# EAGLE design untitled (EAGLE 9.1.0)
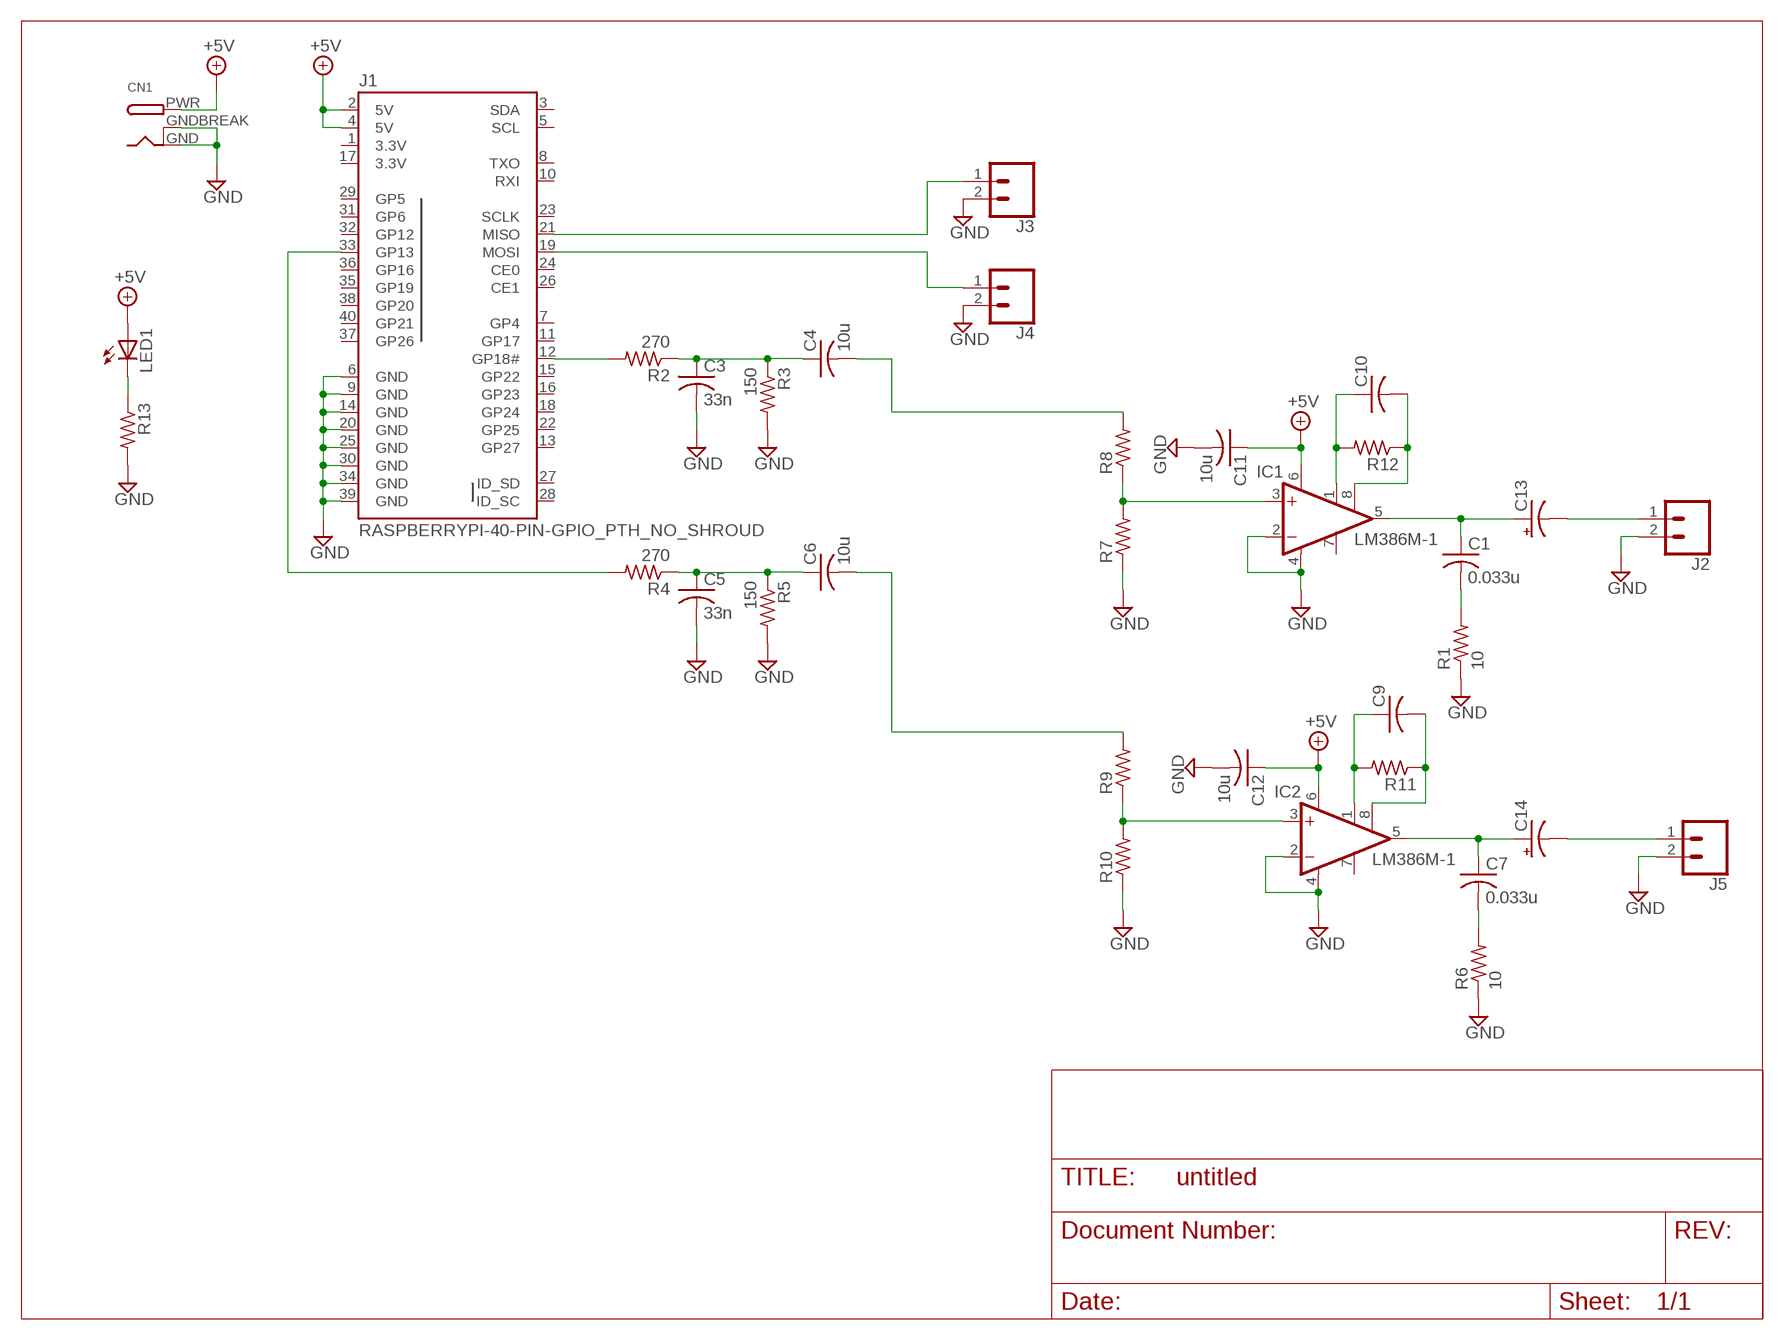
[diagram p0: schematic, sheet 1]

## Parts
C1  0.033u  C-USC0805  [C0805]
C3  33n  C-USC0805  [C0805]
C4  10u  C-USC0805  [C0805]
C5  33n  C-USC0805  [C0805]
C6  10u  C-USC0805  [C0805]
C7  0.033u  C-USC0805  [C0805]
C9  C-USC0805  [C0805]
C10  C-USC0805  [C0805]
C11  10u  C-USC0805  [C0805]
C12  10u  C-USC0805  [C0805]
C13  CPOL-USD  [PANASONIC_D]
C14  CPOL-USD  [PANASONIC_D]
CN1  DCBARRELPTH  [DCJACK_2MM_PTH]
IC1  LM386M-1  [SO08]
IC2  LM386M-1  [SO08]
J1  RASPBERRYPI-40-PIN-GPIO_PTH_NO_SHROUD  [2X20]
J2  CONN_02  [1X02]
J3  CONN_02  [1X02]
J4  CONN_02  [1X02]
J5  CONN_02  [1X02]
LED1  LEDCHIP-LED0805  [CHIP-LED0805]
R1  10  R-US_R0805  [R0805]
R2  270  R-US_R0805  [R0805]
R3  150  R-US_R0805  [R0805]
R4  270  R-US_R0805  [R0805]
R5  150  R-US_R0805  [R0805]
R6  10  R-US_R0805  [R0805]
R7  R-US_R0805  [R0805]
R8  R-US_R0805  [R0805]
R9  R-US_R0805  [R0805]
R10  R-US_R0805  [R0805]
R11  R-US_R0805  [R0805]
R12  R-US_R0805  [R0805]
R13  R-US_R0805  [R0805]

## Nets
+5V: C11.1 C12.1 CN1.PWR IC1.6(VS) IC2.6(VS) J1.2(5V) J1.4(5V) LED1.A
AUDIO_0: C4.2 R8.2
AUDIO_1: C6.2 R9.2
GND: C3.2 C5.2 C11.2 C12.2 CN1.GND CN1.GNDBREAK IC1.2(-IN) IC1.4(GND) IC2.2(-IN) IC2.4(GND) J1.6(GND) J1.9(GND) J1.14(GND) J1.20(GND) J1.25(GND) J1.30(GND) J1.34(GND) J1.39(GND) J2.2 J3.2 J4.2 J5.2 R1.1 R3.2 R5.2 R6.1 R7.1 R10.1 R13.2
N$1: C1.1 C13.+ IC1.5(OUT)
N$2: C1.2 R1.2
N$3: C13.- J2.1
N$4: J1.21(MISO) J3.1
N$5: J1.19(MOSI) J4.1
N$6: J1.12(GP18#) R2.2
N$7: J1.33(GP13) R4.2
N$8: C3.1 C4.1 R2.1 R3.1
N$9: C5.1 C6.1 R4.1 R5.1
N$10: C7.1 C14.+ IC2.5(OUT)
N$11: C7.2 R6.2
N$12: C14.- J5.1
N$13: IC2.3(+IN) R9.1 R10.2
N$14: IC1.3(+IN) R7.2 R8.1
N$15: C9.1 IC2.1(GAIN) R11.2
N$16: C9.2 IC2.8(GAIN) R11.1
N$17: C10.1 IC1.1(GAIN) R12.2
N$18: C10.2 IC1.8(GAIN) R12.1
N$19: LED1.C R13.1
Unconnected: IC1.7(BYPASS) IC2.7(BYPASS) J1.3(SDA) J1.5(SCL) J1.7(GP4) J1.8(TXO) J1.10(RXI) J1.11(GP17) J1.13(GP27) J1.15(GP22) J1.16(GP23) J1.18(GP24) J1.22(GP25) J1.23(SCLK) J1.24(CE0) J1.26(CE1) J1.27(ID_SD) J1.28(ID_SC) J1.29(GP5) J1.31(GP6) J1.32(GP12) J1.35(GP19) J1.36(GP16) J1.37(GP26) J1.38(GP20) J1.40(GP21)

## Power pins joined to a net without a drawn wire
3.3V: J1.1(3.3V) J1.17(3.3V)

## Library data of the parts
C1 C3-C7 C9-C12 = rcl:C-US: CAPACITOR, American symbol; SPICEPREFIX: C
C13 C14 = rcl:CPOL-US: POLARIZED CAPACITOR, American symbol; SPICEPREFIX: C
CN1 = adafruit:DCBARREL: 2.0mm DC Barrel Jack DCJACK_2MM_PTH - Through Hole Jack (4UConnector: 05537)
IC1 IC2 = linear:LM386?-*: Low Voltage Audio Power Amplifier Source: http://cache.national.com/ds/LM/LM386.pdf
J1 = SparkFun-Connectors:RASPBERRYPI-40-PIN-GPIO: Raspberry Pi GPIO Header 2x20 pin connector, as found on B, B+, A+ models. Both shrouded PTH and SMT versions available. SparkFun Products: GPIO Shrouded Header <https://www.sparkfun.com/products/13054>- PTH SparkFun Pi Wedge (Preassembled) <https://www.sparkfun.com/products/13717>
J2-J5 = SparkFun-Connectors:CONN_02: Multi connection point. Often used as Generic Header-pin footprint for 0.1 inch spaced/style header connections On any of the 0.1 inch spaced packages, you can populate with these: Break Away Headers - Straight <https://www.sparkfun.com/products/116> (PRT-00116) Break Away Male Headers - Right Angle <https://www.sparkfun.com/products/553> (PRT-00553) Female Headers <https://www.sparkfun.com/products/115> (PRT-00115) Break Away Headers - Machine Pin <https://www.sparkfun.com/products/117> (PRT-00117) Break Away Female Headers - Swiss Machine Pin <https://www.sparkfun.com/products/743> (PRT-00743) For SCREWTERMINALS and SPRING TERMINALS visit here: Screw Terimnals on SparkFun.com <https://www.sparkfun.com/search/results?term=Screw+Terminals> (5mm/3.5mm/2.54mm spacing) This device is also useful as a general connection point to wire up your design to another part of your project. Our various solder wires solder well into these plated through hole pads. Hook-Up Wire - Assortment (Stranded, 22 AWG) <https://www.sparkfun.com/products/11375> (PRT-11375) Hook-Up Wire - Assortment (Solid Core, 22 AWG) <https://www.sparkfun.com/products/11367> (PRT-11367) View the entire wire category on our website here <https://www.sparkfun.com/categories/141> Special notes: Molex polarized connector foot print use with: PRT-08233 with associated crimp pins and housings. 2.54_SCREWTERM for use with PRT-10571. 3.5mm Screw Terminal footprints for PRT-08084 5mm Screw Terminal footprints for use with PRT-08432
LED1 = led:LED: LED OSRAM: - CHIPLED LG R971, LG N971, LY N971, LG Q971, LY Q971, LO R971, LY R971 LH N974, LH R974 LS Q976, LO Q976, LY Q976 LO Q996 - Hyper CHIPLED LW Q18S LB Q993, LB Q99A, LB R99A - SideLED LS A670, LO A670, LY A670, LG A670, LP A670 LB A673, LV A673, LT A673, LW A673 LH A674 LY A675 LS A676, LA A676, LO A676, LY A676, LW A676 LS A679, LY A679, LG A679 - Hyper Micro SIDELED® LS Y876, LA Y876, LO Y876, LY Y876 LT Y87S - SmartLED LW L88C, LW L88S LB L89C, LB L89S, LG L890 LS L89K, LO L89K, LY L89K LS L896, LA L896, LO L896, LY L896 - TOPLED LS T670, LO T670, LY T670, LG T670, LP T670 LSG T670, LSP T670, LSY T670, LOP T670, LYG T670 LG T671, LOG T671, LSG T671 LB T673, LV T673, LT T673, LW T673 LH T674 LS T676, LA T676, LO T676, LY T676, LB T676, LH T676, LSB T676, LW T676 LB T67C, LV T67C, LT T67C, LS T67K, LO T67K, LY T67K, LW E67C LS E67B, LA E67B, LO E67B, LY E67B, LB E67C, LV E67C, LT E67C LW T67C LS T679, LY T679, LG T679 LS T770, LO T770, LY T770, LG T770, LP T770 LB T773, LV T773, LT T773, LW T773 LH T774 LS E675, LA E675, LY E675, LS T675 LS T776, LA T776, LO T776, LY T776, LB T776 LHGB T686 LT T68C, LB T68C - Hyper Mini TOPLED® LB M676 - Mini TOPLED Santana® LG M470 LS M47K, LO M47K, LY M47K Source: http://www.osram.convergy.de LUXEON: - LUMILED® LXK2-PW12-R00, LXK2-PW12-S00, LXK2-PW14-U00, LXK2-PW14-V00 LXK2-PM12-R00, LXK2-PM12-S00, LXK2-PM14-U00 LXK2-PE12-Q00, LXK2-PE12-R00, LXK2-PE12-S00, LXK2-PE14-T00, LXK2-PE14-U00 LXK2-PB12-K00, LXK2-PB12-L00, LXK2-PB12-M00, LXK2-PB14-N00, LXK2-PB14-P00, LXK2-PB14-Q00 LXK2-PR12-L00, LXK2-PR12-M00, LXK2-PR14-Q00, LXK2-PR14-R00 LXK2-PD12-Q00, LXK2-PD12-R00, LXK2-PD12-S00 LXK2-PH12-R00, LXK2-PH12-S00 LXK2-PL12-P00, LXK2-PL12-Q00, LXK2-PL12-R00 Source: www.luxeon.com KINGBRIGHT: KA-3528ASYC Source: www.kingbright.com
R1-R13 = rcl:R-US_: RESISTOR, American symbol; SPICEPREFIX: R

## Board
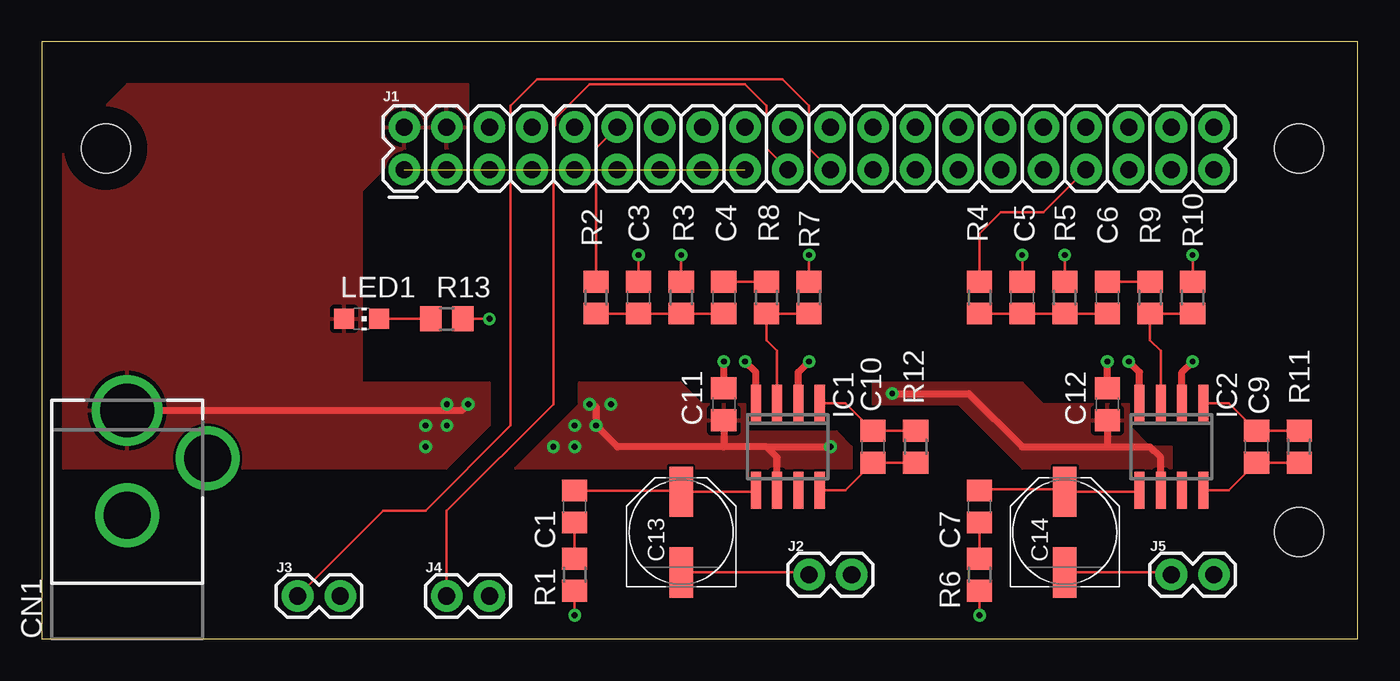
[diagram p1: board, top side]
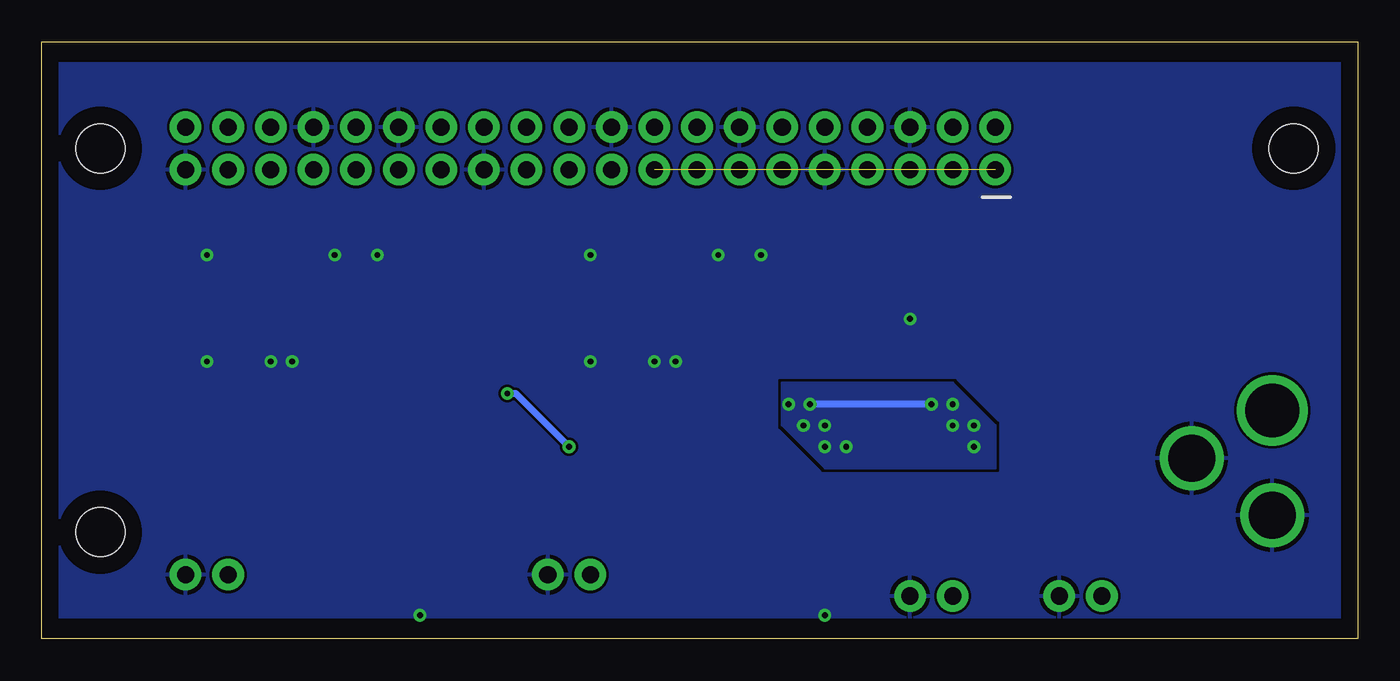
[diagram p2: board, bottom side, seen from below]

Size 78.41 x 35.55 mm. Coordinates in mm from the lower left corner, seen from the top.
Outline: 0,0 78.41,0 78.41,35.55 0,35.55 0,0
Copper layers (1*16): Top 0.035mm / dielectric 1.5mm / Bottom 0.035mm
Design rules "default *": minimum track width 6mil, minimum drill 0.35mm, track to track 6mil, track to pad 6mil, pad to pad 6mil, via to via 6mil, smd to smd 6mil, copper to edge 40mil, drill to drill 6mil, minimum pad ring 10mil, minimum via ring 8mil, stop-mask expansion 4mil, vias tented up to drill 15mil, thermal gap 10mil
Holes 2.92 mm at 74.93,29.21 74.93,6.35 3.81,29.21

### Footprints (pad centres in the part's own frame; a part is rotated, then mirrored left to right if it is on the bottom)
C0805 = smd 1.3 x 1.5: 1 -0.95,0; 2 0.95,0
PANASONIC_D = smd 3 x 1.4: + 2.4,0; - -2.4,0
DCJACK_2MM_PTH = drill 2.8: GND 0,7.35; GNDBREAK 4.8,10.75 | drill 3.2: PWR 0,13.6
SO08 = smd 0.6 x 2.2: 1 -1.905,-2.6; 2 -0.635,-2.6; 3 0.635,-2.6; 4 1.905,-2.6; 5 1.905,2.6; 6 0.635,2.6; 7 -0.635,2.6; 8 -1.905,2.6
2X20 = drill 1.016 pad 1.88: 1 0,0; 2 0,2.54; 3 2.54,0; 4 2.54,2.54; 5 5.08,0; 6 5.08,2.54; 7 7.62,0; 8 7.62,2.54; 9 10.16,0; 10 10.16,2.54; 11 12.7,0; 12 12.7,2.54; 13 15.24,0; 14 15.24,2.54; 15 17.78,0; 16 17.78,2.54; 17 20.32,0; 18 20.32,2.54; 19 22.86,0; 20 22.86,2.54; 21 25.4,0; 22 25.4,2.54; 23 27.94,0; 24 27.94,2.54; 25 30.48,0; 26 30.48,2.54; 27 33.02,0; 28 33.02,2.54; 29 35.56,0; 30 35.56,2.54; 31 38.1,0; 32 38.1,2.54; 33 40.64,0; 34 40.64,2.54; 35 43.18,0; 36 43.18,2.54; 37 45.72,0; 38 45.72,2.54; 39 48.26,0; 40 48.26,2.54
1X02 = drill 1.016 pad 1.88: 1 0,0; 2 2.54,0
CHIP-LED0805 = smd 1.2 x 1.2: A 0,-1.05; C 0,1.05
R0805 = smd 1.3 x 1.5: 1 -0.95,0; 2 0.95,0

### Placement (x,y rotation side)
C1  31.75,7.87 270 top
C3  35.56,20.32 90 top
C4  40.64,20.32 90 top
C5  58.42,20.32 90 top
C6  63.5,20.32 90 top
C7  55.88,7.87 270 top
C9  72.39,11.43 270 top
C10  49.53,11.43 270 top
C11  40.64,13.97 90 top
C12  63.5,13.97 90 top
C13  38.1,6.35 90 top
C14  60.96,6.35 90 top
CN1  5.08,0 0 top
IC1  44.45,11.43 180 top
IC2  67.31,11.43 180 top
J1  21.59,27.94 0 top
J2  45.72,3.81 0 top
J3  15.24,2.54 0 top
J4  24.13,2.54 0 top
J5  67.31,3.81 0 top
LED1  19.05,19.05 270 top
R1  31.75,3.81 90 top
R2  33.02,20.32 90 top
R3  38.1,20.32 90 top
R4  55.88,20.32 90 top
R5  60.96,20.32 90 top
R6  55.88,3.81 90 top
R7  45.72,20.32 270 top
R8  43.18,20.32 90 top
R9  66.04,20.32 90 top
R10  68.58,20.32 270 top
R11  74.93,11.43 90 top
R12  52.07,11.43 90 top
R13  24.13,19.05 0 top

### Tracks (layer width: path | path; a pad name or v marks a point on that pad's centre or on a via)
3.3V  (1 unrouted)
+5V  (via drill 0.35)
  Top 0.406: CN1.PWR 25.03,13.6 v25.4,13.97 | 43.18,11.43 40.64,11.43 | 40.64,11.43 34.29,11.43 v33.02,12.7 33.02,13.84 32.77,13.84 v32.64,13.97 | IC1.6 43.81,10.79 43.18,11.43 | 43.18,11.43 v46.99,11.43 | v50.67,14.61 55.24,14.61 58.42,11.43 63.5,11.43 | 63.5,11.43 66.04,11.43 66.67,10.79 IC2.6 | C11.1 40.64,11.43 | C12.1 63.5,11.43
  Bottom 0.406: v25.4,13.97 v32.64,13.97 | v46.99,11.43 50.16,14.61 v50.67,14.61
  other vias: 24.13,13.97 24.13,12.7 22.86,12.7 22.86,11.43 33.91,13.97 31.75,12.7 31.75,11.43 30.48,11.43
  pour Top: 1.27,10.16 19.05,10.16 24.13,10.16 26.67,12.7 26.67,15.24 19.05,15.24 19.05,26.67 21.59,29.21 25.4,29.21 25.4,33.02 5.08,33.02 1.27,29.21
  pour Top: 32,15.24 35.56,15.24 38.1,15.24 39.37,13.97 41.91,13.97 41.91,12.32 47.37,12.32 48.26,11.43 48.26,10.16 44.45,10.16 43.18,10.16 28.19,10.16 32,13.97
  pour Bottom (isolate 0.305): 25.4,15.24 33.02,15.24 34.29,15.24 34.29,12.7 31.75,10.16 21.59,10.16 21.59,12.7 24.13,15.24
  pour Top: 49.53,15.24 58.42,15.24 59.69,13.97 64.77,13.97 64.77,12.7 66.04,11.43 67.31,11.43 67.31,10.16 64.77,10.16 62.23,10.16 58.42,10.16 54.61,13.97 49.53,13.97
AUDIO_0
  Top 0.152: C4.2 R8.2
AUDIO_1
  Top 0.152: C6.2 R9.2
GND  (via drill 0.35)
  Top 0.152: C3.2 v35.56,22.86 | R3.2 v38.1,22.86 | R7.1 v45.72,22.86 | C5.2 v58.42,22.86 | R5.2 v60.96,22.86 | R10.1 v68.58,22.86 | R13.2 v26.67,19.05 | R6.1 v55.88,1.39 | R1.1 v31.75,1.39
  Top 0.406: C12.2 v63.5,16.51 | C11.2 v40.64,16.51 | IC1.4 42.55,15.88 v41.91,16.51 | IC2.4 65.41,15.88 v64.77,16.51 | IC2.2 67.94,15.88 v68.58,16.51 | IC1.2 45.09,15.88 v45.72,16.51
  pour Bottom (rank 2): 0,34.29 0,1.27 78.74,1.27 78.74,26.67 78.74,34.29 2.54,34.29
N$1
  Top 0.152: IC1.5 42.47,8.75 C13.+ 38.24,8.75 38.17,8.82 C1.1
N$2
  Top 0.152: R1.2 C1.2
N$3
  Top 0.152: 45.72,4.13 J2.1 45.58,3.95 C13.-
N$4
  Top 0.152: J1.21 45.72,29.21 45.72,31.75 44.15,33.33 29.52,33.33 27.94,31.75 27.94,12.7 22.86,7.62 20.32,7.62 J3.1
N$5
  Top 0.152: J1.19 43.18,29.21 43.18,31.75 41.91,33.02 32.64,33.02 30.58,30.96 30.58,30.58 30.48,30.48 30.48,13.97 24.13,7.62 J4.1
N$6
  Top 0.152: R2.2 33.02,29.21 J1.12
N$7
  Top 0.152: J1.33 59.69,25.4 57.15,25.4 55.88,24.13 R4.2
N$8
  Top 0.152: R2.1 C3.1 R3.1 C4.1
N$9
  Top 0.152: R4.1 C5.1 R5.1 C6.1
N$10
  Top 0.152: IC2.5 65.33,8.75 C14.+ 60.82,8.89 55.95,8.89 C7.1
N$11
  Top 0.152: C7.2 R6.2
N$12
  Top 0.152: 67.63,3.81 J5.1 67.17,3.95 C14.-
N$13
  Top 0.152: R10.2 R9.1 66.04,17.78 66.67,17.14 IC2.3
N$14
  Top 0.152: R7.2 R8.1 43.18,17.78 43.81,17.14 IC1.3
N$15
  Top 0.152: IC2.1 70.74,14.03 C9.1 R11.2
N$16
  Top 0.152: IC2.8 70.74,8.83 C9.2 R11.1
N$17
  Top 0.152: IC1.1 47.88,14.03 C10.1 R12.2
N$18
  Top 0.152: IC1.8 47.88,8.83 C10.2 R12.1
N$19
  Top 0.152: LED1.C R13.1